# EAGLE design RAM_TheoreticalDiagram (EAGLE 7.6.0)
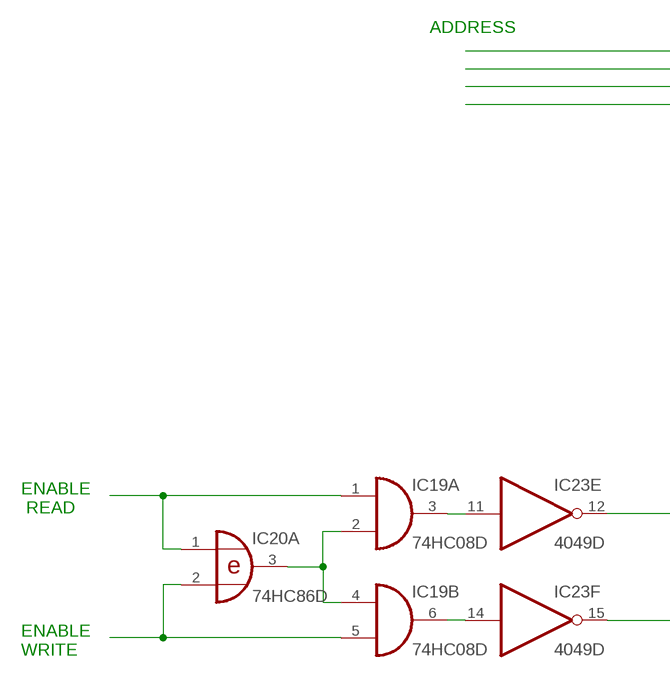
[diagram p0: schematic, sheet 1, part 1 of 2]
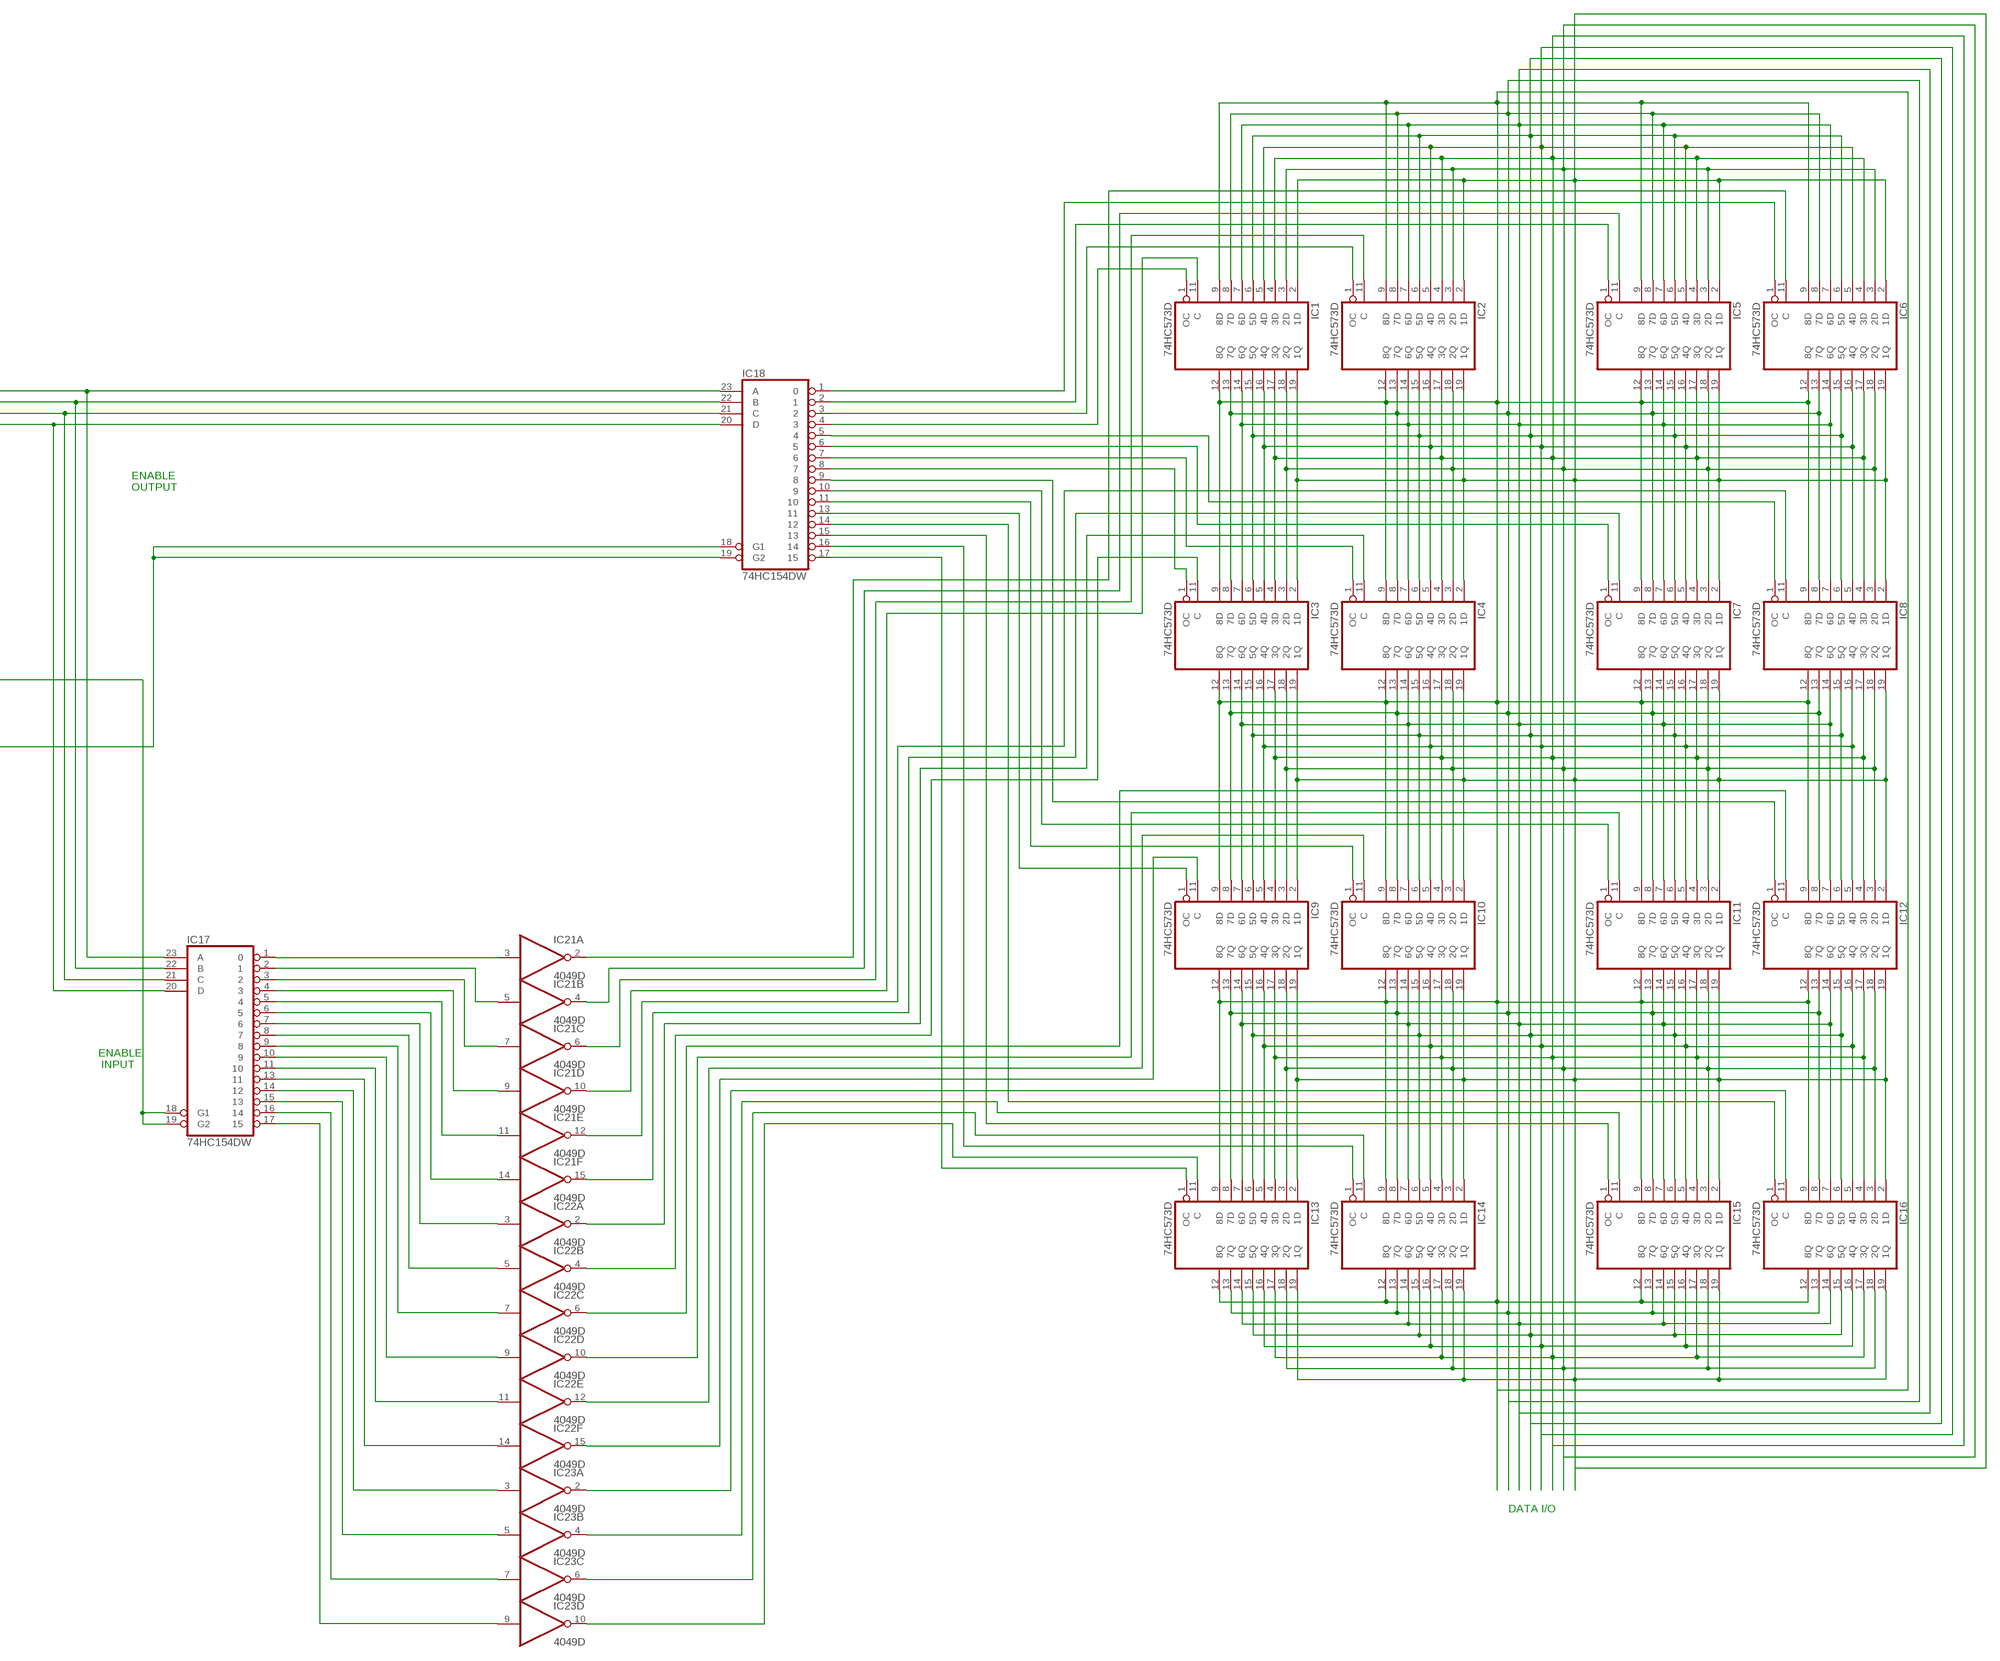
[diagram p1: schematic, sheet 1, part 2 of 2]

## Parts
IC1  74HC573D  [SO20W]
IC2  74HC573D  [SO20W]
IC3  74HC573D  [SO20W]
IC4  74HC573D  [SO20W]
IC5  74HC573D  [SO20W]
IC6  74HC573D  [SO20W]
IC7  74HC573D  [SO20W]
IC8  74HC573D  [SO20W]
IC9  74HC573D  [SO20W]
IC10  74HC573D  [SO20W]
IC11  74HC573D  [SO20W]
IC12  74HC573D  [SO20W]
IC13  74HC573D  [SO20W]
IC14  74HC573D  [SO20W]
IC15  74HC573D  [SO20W]
IC16  74HC573D  [SO20W]
IC17  74HC154DW  [SO24W]
IC18  74HC154DW  [SO24W]
IC19  74HC08D  [SO14]
IC20  74HC86D  [SO14]
IC21  4049D  [SO16]
IC22  4049D  [SO16]
IC23  4049D  [SO16]

## Nets
N$1: IC16.11(C) IC23.2(A:O)
N$2: IC16.1(OC) IC18.14
N$3: IC15.11(C) IC23.4(B:O)
N$4: IC15.1(OC) IC18.15
N$5: IC14.11(C) IC23.6(C:O)
N$6: IC14.1(OC) IC18.16
N$7: IC13.11(C) IC23.10(D:O)
N$8: IC13.1(OC) IC18.17
N$9: IC12.11(C) IC22.6(C:O)
N$11: IC1.9(8D) IC1.12(8Q) IC2.9(8D) IC2.12(8Q) IC3.9(8D) IC3.12(8Q) IC4.9(8D) IC4.12(8Q) IC5.9(8D) IC5.12(8Q) IC6.9(8D) IC6.12(8Q) IC7.9(8D) IC7.12(8Q) IC8.9(8D) IC8.12(8Q) IC9.9(8D) IC9.12(8Q) IC10.9(8D) IC10.12(8Q) IC11.9(8D) IC11.12(8Q) IC12.9(8D) IC12.12(8Q) IC13.9(8D) IC13.12(8Q) IC14.9(8D) IC14.12(8Q) IC15.9(8D) IC15.12(8Q) IC16.9(8D) IC16.12(8Q)
N$12: IC1.8(7D) IC1.13(7Q) IC2.8(7D) IC2.13(7Q) IC3.8(7D) IC3.13(7Q) IC4.8(7D) IC4.13(7Q) IC5.8(7D) IC5.13(7Q) IC6.8(7D) IC6.13(7Q) IC7.8(7D) IC7.13(7Q) IC8.8(7D) IC8.13(7Q) IC9.8(7D) IC9.13(7Q) IC10.8(7D) IC10.13(7Q) IC11.8(7D) IC11.13(7Q) IC12.8(7D) IC12.13(7Q) IC13.8(7D) IC13.13(7Q) IC14.8(7D) IC14.13(7Q) IC15.8(7D) IC15.13(7Q) IC16.8(7D) IC16.13(7Q)
N$13: IC12.1(OC) IC18.9
N$14: IC10.11(C) IC22.12(E:O)
N$15: IC11.11(C) IC22.10(D:O)
N$16: IC11.1(OC) IC18.10
N$17: IC10.1(OC) IC18.11
N$18: IC9.11(C) IC22.15(F:O)
N$19: IC9.1(OC) IC18.13
N$20: IC8.1(OC) IC18.5
N$21: IC19.2(A:I1) IC19.4(B:I0) IC20.3(A:O)
N$22: IC8.11(C) IC21.12(E:O)
N$23: IC7.11(C) IC21.15(F:O)
N$24: IC7.1(OC) IC18.6
N$27: IC1.5(4D) IC1.16(4Q) IC2.5(4D) IC2.16(4Q) IC3.5(4D) IC3.16(4Q) IC4.5(4D) IC4.16(4Q) IC5.5(4D) IC5.16(4Q) IC6.5(4D) IC6.16(4Q) IC7.5(4D) IC7.16(4Q) IC8.5(4D) IC8.16(4Q) IC9.5(4D) IC9.16(4Q) IC10.5(4D) IC10.16(4Q) IC11.5(4D) IC11.16(4Q) IC12.5(4D) IC12.16(4Q) IC13.5(4D) IC13.16(4Q) IC14.5(4D) IC14.16(4Q) IC15.5(4D) IC15.16(4Q) IC16.5(4D) IC16.16(4Q)
N$28: IC19.1(A:I0) IC20.1(A:I0)
N$29: IC4.11(C) IC22.2(A:O)
N$30: IC4.1(OC) IC18.7
N$31: IC3.11(C) IC22.4(B:O)
N$32: IC1.3(2D) IC1.18(2Q) IC2.3(2D) IC2.18(2Q) IC3.3(2D) IC3.18(2Q) IC4.3(2D) IC4.18(2Q) IC5.3(2D) IC5.18(2Q) IC6.3(2D) IC6.18(2Q) IC7.3(2D) IC7.18(2Q) IC8.3(2D) IC8.18(2Q) IC9.3(2D) IC9.18(2Q) IC10.3(2D) IC10.18(2Q) IC11.3(2D) IC11.18(2Q) IC12.3(2D) IC12.18(2Q) IC13.3(2D) IC13.18(2Q) IC14.3(2D) IC14.18(2Q) IC15.3(2D) IC15.18(2Q) IC16.3(2D) IC16.18(2Q)
N$33: IC3.1(OC) IC18.8
N$34: IC6.11(C) IC21.2(A:O)
N$35: IC6.1(OC) IC18.1
N$36: IC5.11(C) IC21.4(B:O)
N$37: IC5.1(OC) IC18.2
N$38: IC2.11(C) IC21.6(C:O)
N$39: IC2.1(OC) IC18.3
N$40: IC1.11(C) IC21.10(D:O)
N$41: IC1.1(OC) IC18.4
N$42: IC18.18(G1) IC18.19(G2) IC23.15(F:O)
N$43: IC17.18(G1) IC17.19(G2) IC23.12(E:O)
N$46: IC19.5(B:I1) IC20.2(A:I1)
N$47: IC17.1 IC21.3(A:I)
N$48: IC17.23(A) IC18.23(A)
N$49: IC17.22(B) IC18.22(B)
N$50: IC17.21(C) IC18.21(C)
N$51: IC17.20(D) IC18.20(D)
N$52: IC17.2 IC21.5(B:I)
N$53: IC17.3 IC21.7(C:I)
N$54: IC17.4 IC21.9(D:I)
N$55: IC17.5 IC21.11(E:I)
N$56: IC17.6 IC21.14(F:I)
N$58: IC17.7 IC22.3(A:I)
N$59: IC17.8 IC22.5(B:I)
N$60: IC17.9 IC22.7(C:I)
N$61: IC17.10 IC22.9(D:I)
N$62: IC17.11 IC22.11(E:I)
N$64: IC17.13 IC22.14(F:I)
N$66: IC17.14 IC23.3(A:I)
N$67: IC17.15 IC23.5(B:I)
N$68: IC17.16 IC23.7(C:I)
N$69: IC17.17 IC23.9(D:I)
N$70: IC1.7(6D) IC1.14(6Q) IC2.7(6D) IC2.14(6Q) IC3.7(6D) IC3.14(6Q) IC4.7(6D) IC4.14(6Q) IC5.7(6D) IC5.14(6Q) IC6.7(6D) IC6.14(6Q) IC7.7(6D) IC7.14(6Q) IC8.7(6D) IC8.14(6Q) IC9.7(6D) IC9.14(6Q) IC10.7(6D) IC10.14(6Q) IC11.7(6D) IC11.14(6Q) IC12.7(6D) IC12.14(6Q) IC13.7(6D) IC13.14(6Q) IC14.7(6D) IC14.14(6Q) IC15.7(6D) IC15.14(6Q) IC16.7(6D) IC16.14(6Q)
N$72: IC19.3(A:O) IC23.11(E:I)
N$73: IC19.6(B:O) IC23.14(F:I)
N$98: IC1.2(1D) IC1.19(1Q) IC2.2(1D) IC2.19(1Q) IC3.2(1D) IC3.19(1Q) IC4.2(1D) IC4.19(1Q) IC5.2(1D) IC5.19(1Q) IC6.2(1D) IC6.19(1Q) IC7.2(1D) IC7.19(1Q) IC8.2(1D) IC8.19(1Q) IC9.2(1D) IC9.19(1Q) IC10.2(1D) IC10.19(1Q) IC11.2(1D) IC11.19(1Q) IC12.2(1D) IC12.19(1Q) IC13.2(1D) IC13.19(1Q) IC14.2(1D) IC14.19(1Q) IC15.2(1D) IC15.19(1Q) IC16.2(1D) IC16.19(1Q)
N$100: IC1.4(3D) IC1.17(3Q) IC2.4(3D) IC2.17(3Q) IC3.4(3D) IC3.17(3Q) IC4.4(3D) IC4.17(3Q) IC5.4(3D) IC5.17(3Q) IC6.4(3D) IC6.17(3Q) IC7.4(3D) IC7.17(3Q) IC8.4(3D) IC8.17(3Q) IC9.4(3D) IC9.17(3Q) IC10.4(3D) IC10.17(3Q) IC11.4(3D) IC11.17(3Q) IC12.4(3D) IC12.17(3Q) IC13.4(3D) IC13.17(3Q) IC14.4(3D) IC14.17(3Q) IC15.4(3D) IC15.17(3Q) IC16.4(3D) IC16.17(3Q)
N$102: IC1.6(5D) IC1.15(5Q) IC2.6(5D) IC2.15(5Q) IC3.6(5D) IC3.15(5Q) IC4.6(5D) IC4.15(5Q) IC5.6(5D) IC5.15(5Q) IC6.6(5D) IC6.15(5Q) IC7.6(5D) IC7.15(5Q) IC8.6(5D) IC8.15(5Q) IC9.6(5D) IC9.15(5Q) IC10.6(5D) IC10.15(5Q) IC11.6(5D) IC11.15(5Q) IC12.6(5D) IC12.15(5Q) IC13.6(5D) IC13.15(5Q) IC14.6(5D) IC14.15(5Q) IC15.6(5D) IC15.15(5Q) IC16.6(5D) IC16.15(5Q)
Unconnected: IC19.8(C:O) IC19.9(C:I0) IC19.10(C:I1) IC19.11(D:O) IC19.12(D:I0) IC19.13(D:I1) IC20.4(B:I0) IC20.5(B:I1) IC20.6(B:O) IC20.8(C:O) IC20.9(C:I0) IC20.10(C:I1) IC20.11(D:O) IC20.12(D:I0) IC20.13(D:I1)

## Notes on the sheet
- ADDRESS
- ENABLE
  OUTPUT
- ENABLE
   READ
- ENABLE
  WRITE
- ENABLE
   INPUT
- DATA I/O

## Power pins joined to a net without a drawn wire
N$101: IC1.10(GND) IC2.10(GND) IC3.10(GND) IC4.10(GND) IC5.10(GND) IC6.10(GND) IC7.10(GND) IC8.10(GND) IC9.10(GND) IC10.10(GND) IC11.10(GND) IC12.10(GND) IC13.10(GND) IC14.10(GND) IC15.10(GND) IC16.10(GND) IC17.12(GND) IC18.12(GND) IC19.7(P:GND) IC20.7(P:GND)
N$103: IC1.20(VCC) IC2.20(VCC) IC3.20(VCC) IC4.20(VCC) IC5.20(VCC) IC6.20(VCC) IC7.20(VCC) IC8.20(VCC) IC9.20(VCC) IC10.20(VCC) IC11.20(VCC) IC12.20(VCC) IC13.20(VCC) IC14.20(VCC) IC15.20(VCC) IC16.20(VCC) IC17.24(VCC) IC18.24(VCC) IC19.14(P:VCC) IC20.14(P:VCC)
VDD: IC21.1(P:VDD) IC22.1(P:VDD) IC23.1(P:VDD)
VSS: IC21.8(P:VSS) IC22.8(P:VSS) IC23.8(P:VSS)

## Library data of the parts
IC1-IC16 = 74xx-eu:74*573: 8-bit D latch BUS DRIVER
IC17 IC18 = 74xx-eu:74*154: 4-line to 16-line data SELECTOR/MULTIPLEXER
IC19 = 74xx-eu:74*08: Quad 2-input AND gate
IC20 = 74xx-eu:74*86: Quad 2-input EXCLUSIVE-OR (XOR) gate
IC21-IC23 = 40xx:4049: Hex inverting BUFFER

## Board
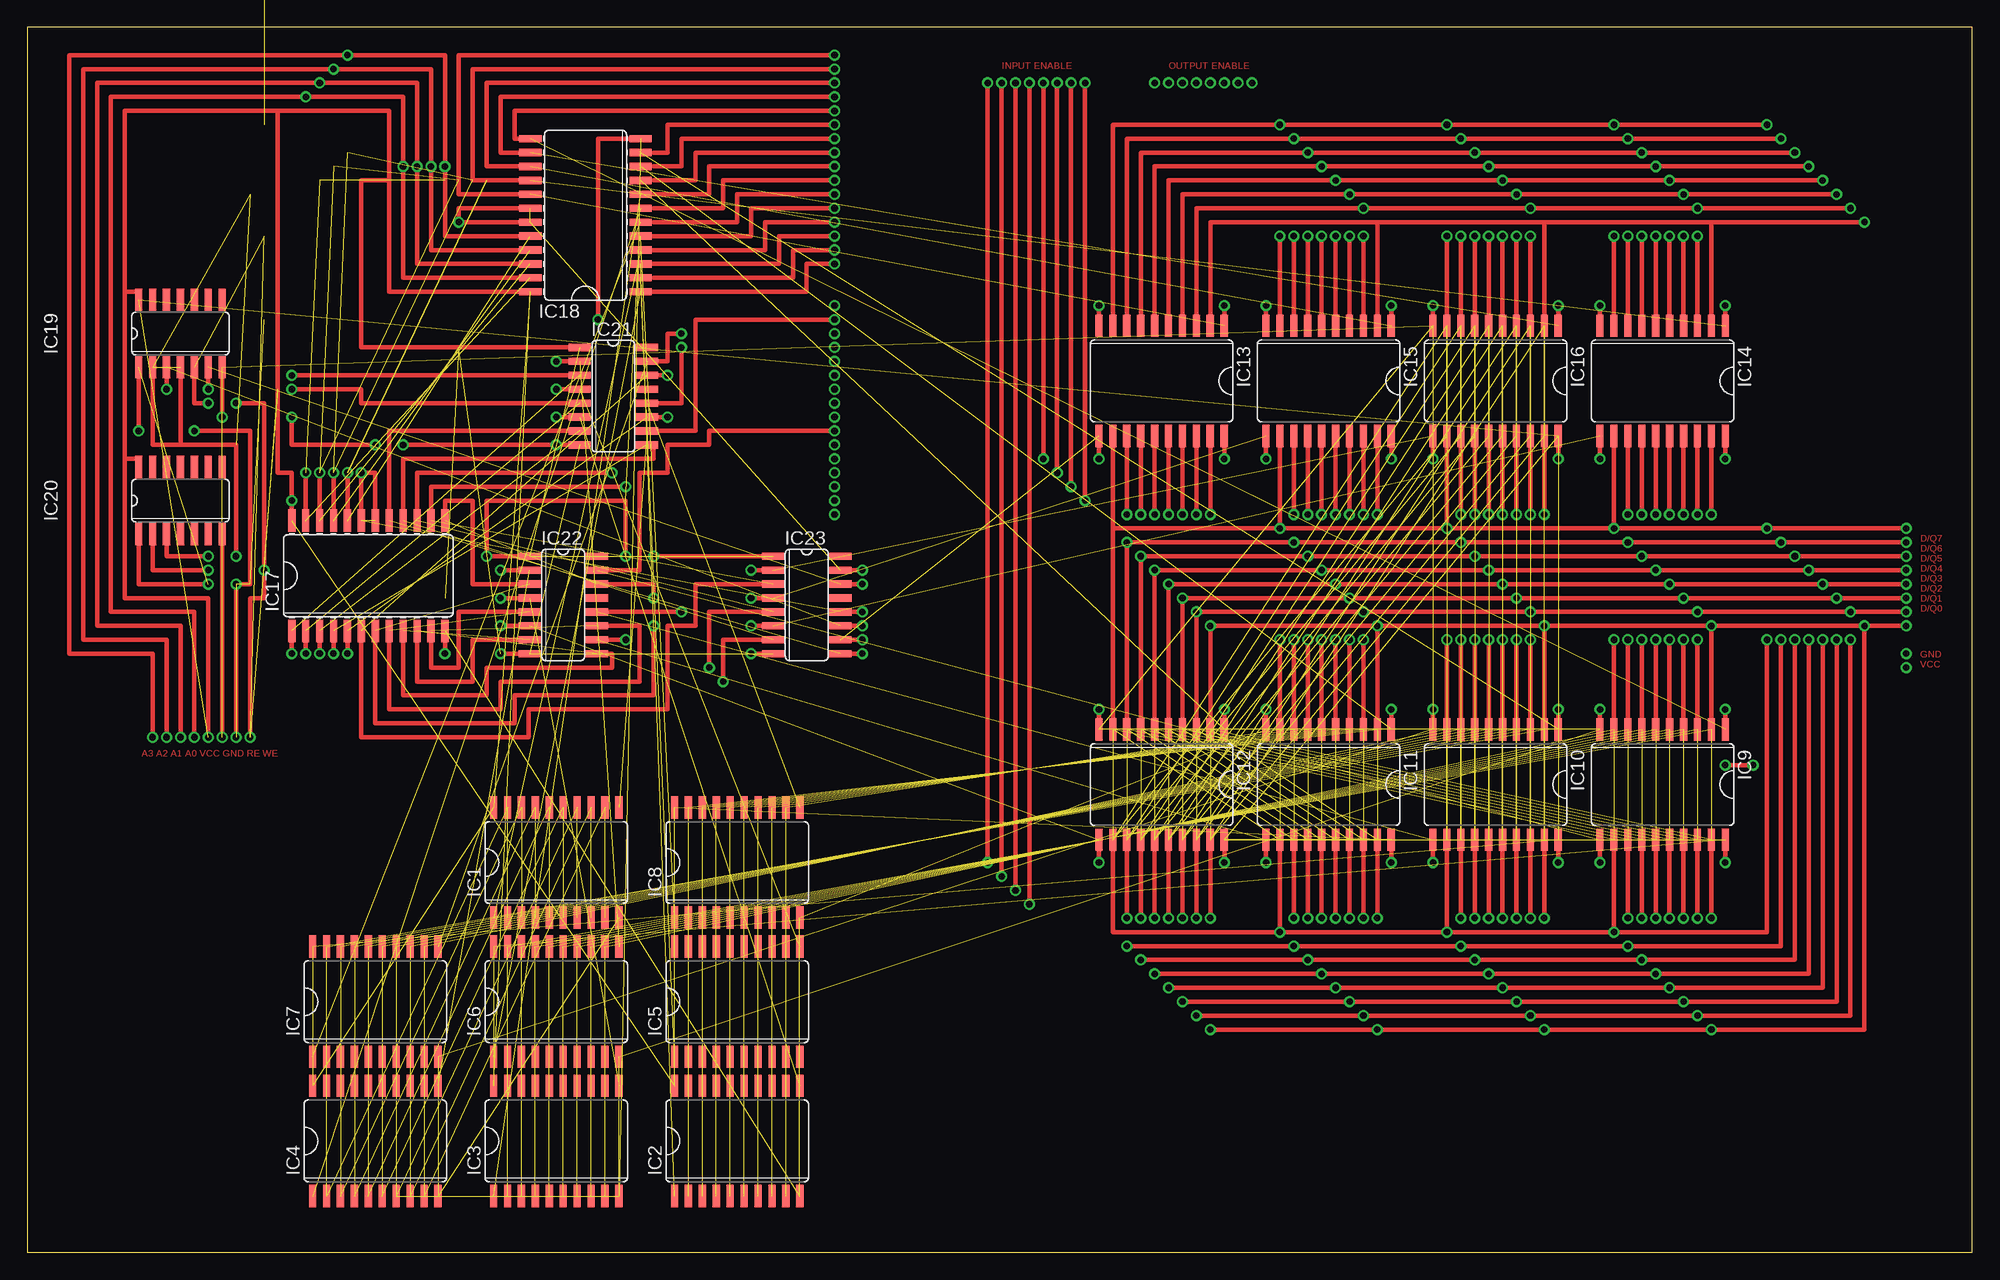
[diagram p2: board, top side]
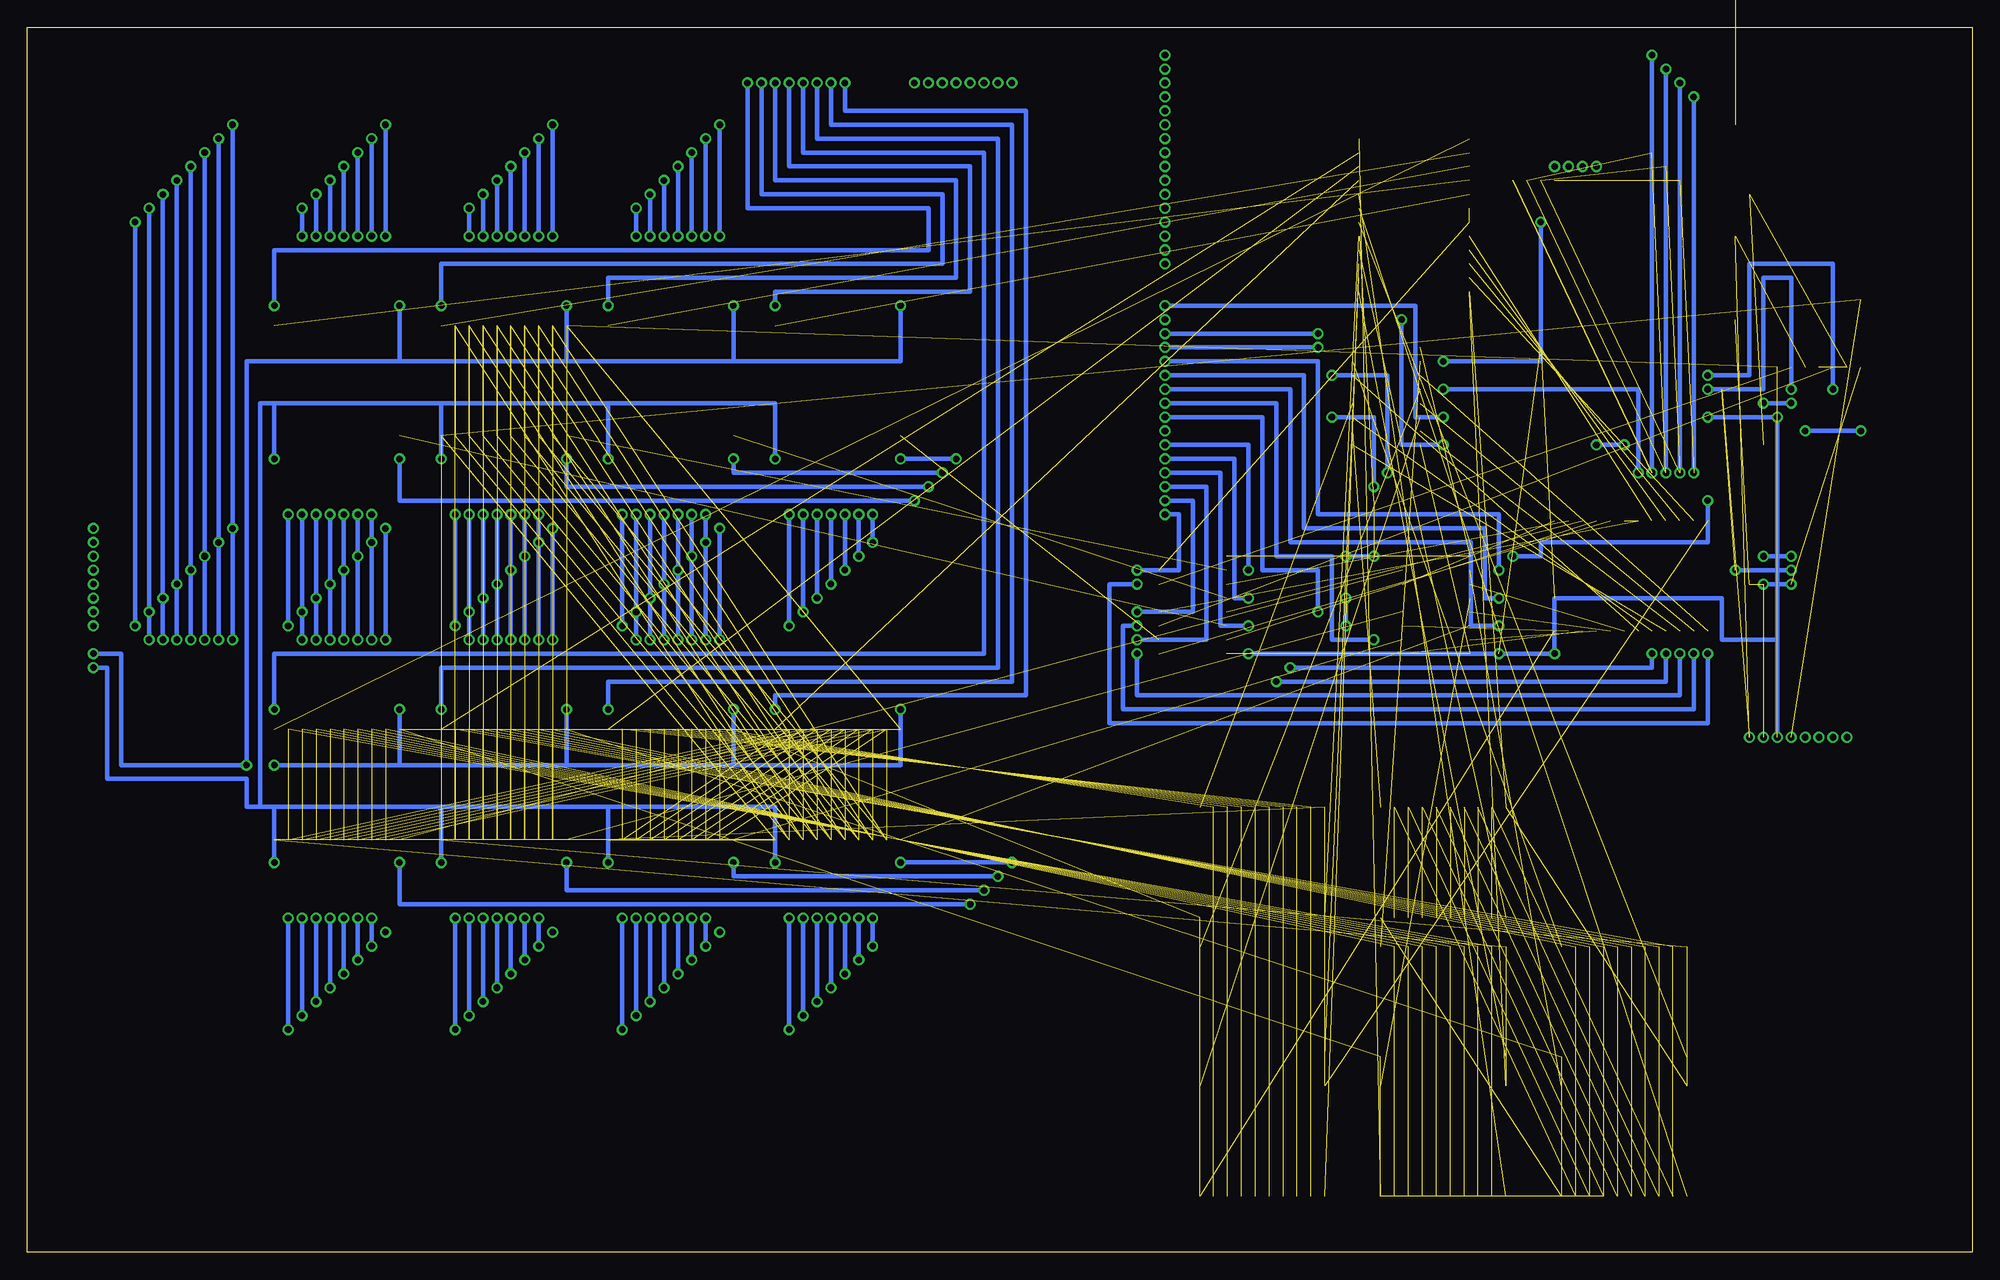
[diagram p3: board, bottom side, seen from below]

Size 177.47 x 111.75 mm. Coordinates in mm from the lower left corner, seen from the top.
Outline: 0,0 177.47,0 177.47,111.75 0,111.75 0,0
Copper layers (1*16): Top 0.035mm / dielectric 1.5mm / Bottom 0.035mm
Design rules "default": minimum track width 6mil, minimum drill 0.35mm, track to track 6mil, track to pad 6mil, pad to pad 6mil, via to via 6mil, smd to smd 6mil, copper to edge 40mil, drill to drill 6mil, minimum pad ring 10mil, minimum via ring 8mil, stop-mask expansion 4mil, vias tented up to drill 0mil, thermal gap 10mil

### Footprints (pad centres in the part's own frame; a part is rotated, then mirrored left to right if it is on the bottom)
SO20W = smd 0.66 x 2.032: 1 -5.715,-5.029; 2 -4.445,-5.029; 3 -3.175,-5.029; 4 -1.905,-5.029; 5 -0.635,-5.029; 6 0.635,-5.029; 7 1.905,-5.029; 8 3.175,-5.029; 9 4.445,-5.029; 10 5.715,-5.029; 11 5.715,5.029; 12 4.445,5.029; 13 3.175,5.029; 14 1.905,5.029; 15 0.635,5.029; 16 -0.635,5.029; 17 -1.905,5.029; 18 -3.175,5.029; 19 -4.445,5.029; 20 -5.715,5.029
SO24W = smd 0.66 x 2.032: 1 -6.985,-5.029; 2 -5.715,-5.029; 3 -4.445,-5.029; 4 -3.175,-5.029; 5 -1.905,-5.029; 6 -0.635,-5.029; 7 0.635,-5.029; 8 1.905,-5.029; 9 3.175,-5.029; 10 4.445,-5.029; 11 5.715,-5.029; 12 6.985,-5.029; 13 6.985,5.029; 14 5.715,5.029; 15 4.445,5.029; 16 3.175,5.029; 17 1.905,5.029; 18 0.635,5.029; 19 -0.635,5.029; 20 -1.905,5.029; 21 -3.175,5.029; 22 -4.445,5.029; 23 -5.715,5.029; 24 -6.985,5.029
SO14 = smd 0.66 x 2.032: 1 -3.81,-3.073; 2 -2.54,-3.073; 3 -1.27,-3.073; 4 0,-3.073; 5 1.27,-3.073; 6 2.54,-3.073; 7 3.81,-3.073; 8 3.81,3.073; 9 2.54,3.073; 10 1.27,3.073; 11 0,3.073; 12 -1.27,3.073; 13 -2.54,3.073; 14 -3.81,3.073
SO16 = smd 0.66 x 2.032: 1 -4.445,-3.073; 2 -3.175,-3.073; 3 -1.905,-3.073; 4 -0.635,-3.073; 5 0.635,-3.073; 6 1.905,-3.073; 7 3.175,-3.073; 8 4.445,-3.073; 9 4.445,3.073; 10 3.175,3.073; 11 1.905,3.073; 12 0.635,3.073; 13 -0.635,3.073; 14 -1.905,3.073; 15 -3.175,3.073; 16 -4.445,3.073

### Placement (x,y rotation side)
IC1  48.26,35.56 0 top
IC2  64.77,10.16 0 top
IC3  48.26,10.16 0 top
IC4  31.75,10.16 0 top
IC5  64.77,22.86 0 top
IC6  48.26,22.86 0 top
IC7  31.75,22.86 0 top
IC8  64.77,35.56 0 top
IC9  149.22,42.67 180 top
IC10  133.99,42.67 180 top
IC11  118.75,42.67 180 top
IC12  103.5,42.67 180 top
IC13  103.5,79.5 180 top
IC14  149.22,79.5 180 top
IC15  118.75,79.5 180 top
IC16  133.99,79.5 180 top
IC17  31.11,61.72 0 top
IC18  50.93,94.61 90 top
IC19  13.97,83.82 0 top
IC20  13.97,68.58 0 top
IC21  53.47,78.11 270 top
IC22  48.9,59.05 270 top
IC23  71.12,59.05 270 top

### Tracks (layer width: path | path; a pad name or v marks a point on that pad's centre or on a via)
N$1  (1 unrouted)
N$2  (1 unrouted)
N$3  (1 unrouted)
N$4  (1 unrouted)
N$5  (1 unrouted)
N$6  (1 unrouted)
N$7  (1 unrouted)
N$8  (1 unrouted)
N$9  (1 unrouted)
N$11  (31 unrouted)
N$12  (31 unrouted)
N$13  (1 unrouted)
N$14  (1 unrouted)
N$15  (1 unrouted)
N$16  (1 unrouted)
N$17  (1 unrouted)
N$18  (1 unrouted)
N$19  (1 unrouted)
N$20  (1 unrouted)
N$21  (via drill 0.6)  (3 unrouted)
  Top 0.406: IC20.3 12.7,63.5 v16.51,63.5 | v19.05,63.5 19.05,73.66 13.97,73.66 | 13.97,73.66 11.43,73.66 11.43,80.01 | 13.97,80.01 13.97,73.66
  Bottom 0.406: v16.51,63.5 v19.05,63.5
N$22  (1 unrouted)
N$23  (1 unrouted)
N$24  (1 unrouted)
N$25  (via drill 0.6)
  other vias: 16.51,46.99
N$26  (via drill 0.6)
  other vias: 19.05,63.5
N$27  (31 unrouted)
N$28  (via drill 0.6)  (4 unrouted)
  Top 0.406: IC20.1 10.16,60.96 v16.51,60.96 | v15.24,74.93 20.32,74.93 20.32,60.96 v19.05,60.96 v19.05,46.99 | v10.16,74.93 10.16,80.01
  Bottom 0.406: v19.05,60.96 v16.51,60.96 | v15.24,74.93 v10.16,74.93
N$29  (1 unrouted)
N$30  (1 unrouted)
N$31  (1 unrouted)
N$32  (31 unrouted)
N$33  (1 unrouted)
N$34  (1 unrouted)
N$35  (1 unrouted)
N$36  (1 unrouted)
N$37  (1 unrouted)
N$38  (1 unrouted)
N$39  (1 unrouted)
N$40  (1 unrouted)
N$41  (1 unrouted)
N$42  (2 unrouted)
N$43  (2 unrouted)
N$44  (via drill 0.6)
  Top 0.406: 49.53,76.2 v48.26,76.2
  Bottom 0.406: v48.26,76.2 50.8,76.2 50.8,86.36 v73.66,86.36
N$45  (via drill 0.6)
  Top 0.406: 12.7,80.01 v12.7,78.74 | v24.13,80.01 49.53,80.01
  Bottom 0.406: v12.7,78.74 12.7,90.17 20.32,90.17 20.32,80.01 v24.13,80.01
N$46  (via drill 0.6)  (4 unrouted)
  Top 0.406: IC20.2 11.43,62.23 v16.51,62.23 | v19.05,77.47 21.59,77.47 v21.59,62.23 21.59,59.69 20.32,59.69 v20.32,46.99 | v16.51,77.47 15.24,77.47 15.24,80.01
  Bottom 0.406: v16.51,62.23 v21.59,62.23 | v19.05,77.47 v16.51,77.47
N$47  (1 unrouted)
N$48  (1 unrouted)
N$49  (1 unrouted)
N$50  (1 unrouted)
N$51  (1 unrouted)
N$52  (1 unrouted)
N$53  (1 unrouted)
N$54  (1 unrouted)
N$55  (1 unrouted)
N$56  (1 unrouted)
N$57  (via drill 0.6)  (3 unrouted)
  Top 0.406: v29.21,71.12 29.21,67.31 | v11.43,46.99 11.43,54.61 3.81,54.61 3.81,109.22 v29.21,109.22 38.1,109.22 v38.1,99.06 38.1,92.71 45.72,92.71
  Bottom 0.406: v29.21,109.22 v29.21,71.12
N$58  (1 unrouted)
N$59  (1 unrouted)
N$60  (1 unrouted)
N$61  (1 unrouted)
N$62  (1 unrouted)
N$63  (via drill 0.6)  (4 unrouted)
  Top 0.406: v12.7,46.99 12.7,55.88 5.08,55.88 5.08,107.95 v27.94,107.95 36.83,107.95 v36.83,99.06 36.83,91.44 45.72,91.44 | v27.94,71.12 27.94,67.31
  Bottom 0.406: v27.94,71.12 v27.94,107.95
N$64  (1 unrouted)
N$65  (via drill 0.6)  (2 unrouted)
  Top 0.406: v15.24,46.99 15.24,58.42 7.62,58.42 7.62,105.41 v25.4,105.41 34.29,105.41 v34.29,99.06 34.29,88.9 45.72,88.9 | v25.4,71.12 25.4,67.31
  Bottom 0.406: v25.4,71.12 v25.4,105.41
N$66  (1 unrouted)
N$67  (1 unrouted)
N$68  (1 unrouted)
N$69  (1 unrouted)
N$70  (31 unrouted)
N$71  (via drill 0.6)  (4 unrouted)
  Top 0.406: v13.97,46.99 13.97,57.15 6.35,57.15 6.35,106.68 v26.67,106.68 35.56,106.68 v35.56,99.06 35.56,90.17 45.72,90.17 | v26.67,71.12 26.67,67.31
  Bottom 0.406: v26.67,106.68 v26.67,71.12
N$72  (1 unrouted)
N$73  (1 unrouted)
N$74  (via drill 0.6)
  Top 0.406: 16.51,80.01 v16.51,78.74 | v24.13,78.74 30.48,78.74 30.48,77.47 49.53,77.47
  Bottom 0.406: v16.51,78.74 16.51,88.9 19.05,88.9 19.05,78.74 v24.13,78.74
N$75
  Top 0.406: 57.15,73.66 57.15,72.39 34.29,72.39 34.29,67.31
N$76  (via drill 0.6)
  Top 0.406: 49.53,78.74 v48.26,78.74 | 31.75,67.31 31.75,71.12 v30.48,71.12 30.48,67.31
  Bottom 0.406: v48.26,78.74 30.48,78.74 v30.48,71.12
N$77  (2 unrouted)
N$78  (via drill 0.6)
  Top 0.406: v76.2,55.88 74.93,55.88
  Bottom 0.406: v76.2,55.88 69.85,55.88 69.85,69.85 v73.66,69.85
N$79  (via drill 0.6)
  Top 0.406: 49.53,81.28 v48.26,81.28 | 45.72,95.25 39.37,95.25 v39.37,93.98 45.72,93.98
  Bottom 0.406: v48.26,81.28 39.37,81.28 v39.37,93.98
N$80  (via drill 0.6)
  Top 0.406: 35.56,67.31 35.56,71.12 v53.34,71.12 | v58.42,80.01 57.15,80.01
  Bottom 0.406: v53.34,71.12 53.34,80.01 v58.42,80.01
N$81
  Top 0.406: 33.02,67.31 33.02,74.93 49.53,74.93
N$82
  Top 0.406: 35.56,55.88 35.56,52.07 40.64,52.07 40.64,55.88 45.72,55.88
N$83  (via drill 0.6)
  Top 0.406: 36.83,67.31 36.83,69.85 v54.61,69.85 | v58.42,76.2 57.15,76.2
  Bottom 0.406: v54.61,69.85 54.61,76.2 v58.42,76.2
N$84  (via drill 0.6)
  Top 0.406: v76.2,58.42 74.93,58.42
  Bottom 0.406: v76.2,58.42 71.12,58.42 71.12,68.58 v73.66,68.58
N$85  (via drill 0.6)
  Top 0.406: 57.15,81.28 58.42,81.28 58.42,83.82 v59.69,83.82
  Bottom 0.406: v73.66,83.82 v59.69,83.82
N$86
  Top 0.406: 45.72,60.96 40.64,60.96 40.64,68.58 38.1,68.58 38.1,67.31
N$87  (via drill 0.6)
  Top 0.406: 57.15,74.93 60.96,74.93 60.96,85.09 v73.66,85.09
N$88  (via drill 0.6)
  Top 0.406: 45.72,62.23 v43.18,62.23
  Bottom 0.406: v43.18,62.23 43.18,67.31 59.69,67.31 59.69,81.28 v73.66,81.28
N$89
  Top 0.406: 36.83,55.88 36.83,53.34 39.37,53.34 39.37,58.42 45.72,58.42
N$90  (via drill 0.6)
  Top 0.406: 45.72,59.69 v43.18,59.69
  Bottom 0.406: v43.18,59.69 44.45,59.69 44.45,66.04 60.96,66.04 60.96,80.01 v73.66,80.01
N$91  (via drill 0.6)
  Top 0.406: 57.15,77.47 59.69,77.47 v59.69,82.55
  Bottom 0.406: v59.69,82.55 v73.66,82.55
N$92  (via drill 0.6)
  Top 0.406: 45.72,57.15 v43.18,57.15
  Bottom 0.406: v43.18,57.15 45.72,57.15 45.72,64.77 62.23,64.77 62.23,78.74 v73.66,78.74
N$93
  Top 0.406: 34.29,55.88 34.29,50.8 41.91,50.8 41.91,53.34 53.34,53.34 53.34,54.61 52.07,54.61
N$94
  Top 0.406: 33.02,55.88 33.02,49.53 43.18,49.53 43.18,52.07 55.88,52.07 55.88,57.15 52.07,57.15
N$95  (via drill 0.6)
  Top 0.406: 53.34,55.88 v54.61,55.88 52.07,55.88
  Bottom 0.406: v54.61,55.88 58.42,55.88 58.42,63.5 63.5,63.5 63.5,77.47 v73.66,77.47
N$96  (via drill 0.6)
  Top 0.406: 52.07,58.42 v59.69,58.42
  Bottom 0.406: v73.66,76.2 64.77,76.2 64.77,62.23 59.69,62.23 v59.69,58.42
N$97  (via drill 0.6)
  Top 0.406: 52.07,62.23 55.88,62.23 55.88,71.12 58.42,71.12 58.42,73.66 62.23,73.66 62.23,74.93 v73.66,74.93
N$98  (31 unrouted)
N$99  (via drill 0.6)
  Top 0.406: 31.75,55.88 31.75,48.26 44.45,48.26 44.45,50.8 57.15,50.8 v57.15,57.15 | v57.15,59.69 57.15,60.96 52.07,60.96
  Bottom 0.406: v57.15,57.15 v57.15,59.69
N$100  (31 unrouted)
N$101  (via drill 0.6)  (21 unrouted)
  Top 0.406: 49.53,73.66 v48.26,73.66 v34.29,73.66 | v31.75,73.66 24.13,73.66 v24.13,76.2 | IC20.7 v17.78,46.99 | 17.78,80.01 v17.78,76.2 | 38.1,55.88 v38.1,54.61 | 45.72,54.61 v43.18,54.61 | 67.31,54.61 v66.04,54.61 | v52.07,85.09 52.07,101.6 55.88,101.6
  Bottom 0.406: v17.78,46.99 17.78,55.88 | 17.78,55.88 v17.78,76.2 v24.13,76.2 | v34.29,73.66 v31.75,73.66 | 17.78,55.88 22.86,55.88 22.86,59.69 38.1,59.69 v38.1,54.61 v43.18,54.61 v66.04,54.61 | v48.26,73.66 52.07,73.66 v52.07,85.09
N$102  (31 unrouted)
N$103  (via drill 0.6)  (21 unrouted)
  Top 0.406: 67.31,63.5 v57.15,63.5 | v54.61,63.5 54.61,68.58 41.91,68.58 v41.91,63.5 45.72,63.5 | 50.8,82.55 30.48,82.55 30.48,97.79 33.02,97.79 | 10.16,87.63 8.89,87.63 | IC20.14 10.16,72.39 8.89,72.39 | 8.89,72.39 8.89,59.69 16.51,59.69 16.51,46.99 | 8.89,87.63 8.89,72.39 | 8.89,87.63 8.89,104.14 22.86,104.14 | 22.86,104.14 33.02,104.14 33.02,97.79 | 22.86,104.14 22.86,71.12 24.13,71.12 v24.13,68.58 24.13,67.31 | 33.02,97.79 33.02,87.63 45.72,87.63
  Bottom 0.406: v24.13,68.58 24.13,64.77 39.37,64.77 39.37,63.5 v41.91,63.5 | v57.15,63.5 v54.61,63.5
N$104  (via drill 0.6)
  Top 0.406: v76.2,62.23 74.93,62.23
  Bottom 0.406: v76.2,62.23 72.39,62.23 72.39,67.31 v73.66,67.31
N$105  (via drill 0.6)
  Top 0.406: 45.72,96.52 39.37,96.52 39.37,109.22 v73.66,109.22
N$106
  Top 0.406: 30.48,55.88 30.48,46.99 45.72,46.99 45.72,49.53 58.42,49.53 58.42,57.15 60.96,57.15 60.96,60.96 67.31,60.96
N$107  (via drill 0.6)
  Top 0.406: 67.31,62.23 v66.04,62.23
  Bottom 0.406: v66.04,62.23 66.04,73.66 v73.66,73.66
N$108  (via drill 0.6)
  Top 0.406: 29.21,55.88 v29.21,54.61 | v62.23,53.34 62.23,58.42 67.31,58.42
  Bottom 0.406: v29.21,54.61 29.21,53.34 v62.23,53.34
N$109  (via drill 0.6)
  Top 0.406: 27.94,55.88 v27.94,54.61 | v63.5,52.07 63.5,55.88 67.31,55.88
  Bottom 0.406: v27.94,54.61 27.94,52.07 v63.5,52.07
N$110  (via drill 0.6)
  Top 0.406: 26.67,55.88 v26.67,54.61 | v76.2,54.61 74.93,54.61
  Bottom 0.406: v26.67,54.61 26.67,50.8 76.2,50.8 v76.2,54.61
N$111  (via drill 0.6)
  Top 0.406: 45.72,97.79 40.64,97.79 40.64,107.95 v73.66,107.95
N$112  (via drill 0.6)
  Top 0.406: 24.13,55.88 v24.13,54.61 | v76.2,60.96 74.93,60.96
  Bottom 0.406: v24.13,54.61 24.13,48.26 78.74,48.26 78.74,60.96 v76.2,60.96
N$113  (via drill 0.6)
  Top 0.406: 67.31,59.69 v66.04,59.69
  Bottom 0.406: v66.04,59.69 67.31,59.69 67.31,72.39 v73.66,72.39
N$114  (via drill 0.6)
  Top 0.406: 67.31,57.15 v66.04,57.15
  Bottom 0.406: v66.04,57.15 68.58,57.15 68.58,71.12 v73.66,71.12
N$115  (via drill 0.6)
  Top 0.406: 45.72,99.06 41.91,99.06 41.91,106.68 v73.66,106.68
N$116  (via drill 0.6)
  Top 0.406: 25.4,55.88 v25.4,54.61 | v76.2,57.15 74.93,57.15
  Bottom 0.406: v76.2,57.15 77.47,57.15 77.47,49.53 25.4,49.53 v25.4,54.61
N$117  (via drill 0.6)
  Top 0.406: 45.72,100.33 43.18,100.33 43.18,105.41 v73.66,105.41
N$118  (via drill 0.6)
  Top 0.406: 45.72,101.6 44.45,101.6 44.45,104.14 v73.66,104.14
N$119  (via drill 0.6)
  Top 0.406: 57.15,100.33 58.42,100.33 58.42,102.87 v73.66,102.87
N$120  (via drill 0.6)
  Top 0.406: 57.15,99.06 59.69,99.06 59.69,101.6 v73.66,101.6
N$121  (via drill 0.6)
  Top 0.406: 57.15,97.79 60.96,97.79 60.96,100.33 v73.66,100.33
N$122  (via drill 0.6)
  Top 0.406: 57.15,96.52 62.23,96.52 62.23,99.06 v73.66,99.06
N$123  (via drill 0.6)
  Top 0.406: 57.15,95.25 63.5,95.25 63.5,97.79 v73.66,97.79
N$124  (via drill 0.6)
  Top 0.406: 57.15,93.98 64.77,93.98 64.77,96.52 v73.66,96.52
N$125  (via drill 0.6)
  Top 0.406: 55.88,92.71 66.04,92.71 66.04,95.25 v73.66,95.25
N$126  (via drill 0.6)
  Top 0.406: 55.88,91.44 67.31,91.44 67.31,93.98 v73.66,93.98
N$127  (via drill 0.6)
  Top 0.406: 55.88,90.17 68.58,90.17 68.58,92.71 v73.66,92.71
N$128  (via drill 0.6)
  Top 0.406: 57.15,88.9 69.85,88.9 69.85,91.44 v73.66,91.44
N$129  (via drill 0.6)
  Top 0.406: 55.88,87.63 71.12,87.63 71.12,90.17 v73.66,90.17
N$130  (via drill 0.6)
  Top 0.406: v109.22,49.53 109.22,48.26
  Bottom 0.406: v109.22,49.53 109.22,50.8 86.36,50.8 86.36,104.14 102.87,104.14 v102.87,106.68
N$131  (via drill 0.6)
  Top 0.406: v109.22,86.36 109.22,85.09
  Bottom 0.406: v109.22,86.36 109.22,87.63 91.44,87.63 91.44,99.06 107.95,99.06 v107.95,106.68
N$132  (via drill 0.6)
  Top 0.406: v124.46,49.53 124.46,48.26
  Bottom 0.406: v124.46,49.53 124.46,52.07 87.63,52.07 87.63,102.87 104.14,102.87 v104.14,106.68
N$135  (via drill 0.6)
  Top 0.406: v114.3,29.21 99.06,29.21 99.06,36.83 | v114.3,29.21 v129.54,29.21 | v129.54,29.21 v144.78,29.21 | v144.78,29.21 158.75,29.21 v158.75,55.88 | 114.3,36.83 v114.3,29.21 | v129.54,29.21 129.54,36.83 | v144.78,29.21 144.78,36.83 | 129.54,85.09 v129.54,92.71 | 144.78,85.09 v144.78,92.71 | 114.3,85.09 v114.3,92.71 | 99.06,85.09 99.06,102.87 v114.3,102.87 v129.54,102.87 v144.78,102.87 v158.75,102.87 | 129.54,48.26 v129.54,55.88 | 144.78,48.26 v144.78,55.88 | 114.3,48.26 v114.3,55.88 | 99.06,48.26 99.06,66.04 | 99.06,66.04 v114.3,66.04 | v114.3,66.04 v129.54,66.04 | v129.54,66.04 v144.78,66.04 | v144.78,66.04 v158.75,66.04 v171.45,66.04 | 99.06,73.66 99.06,66.04 | 114.3,73.66 v114.3,66.04 | v129.54,66.04 129.54,73.66 | v144.78,66.04 144.78,73.66
  Bottom 0.406: v114.3,92.71 v114.3,102.87 | v144.78,92.71 v144.78,102.87 | v129.54,92.71 v129.54,102.87 | v114.3,55.88 v114.3,66.04 | v144.78,55.88 v144.78,66.04 | v129.54,55.88 v129.54,66.04 | v158.75,102.87 v158.75,66.04 v158.75,55.88
N$136  (via drill 0.6)
  Top 0.406: v139.7,49.53 139.7,48.26
  Bottom 0.406: v139.7,49.53 139.7,53.34 88.9,53.34 88.9,101.6 105.41,101.6 v105.41,106.68
N$140  (via drill 0.6)
  Top 0.406: v124.46,86.36 124.46,85.09
  Bottom 0.406: v124.46,86.36 124.46,88.9 92.71,88.9 92.71,97.79 109.22,97.79 v109.22,106.68
N$142  (via drill 0.6)
  Top 0.406: v97.79,35.56 97.79,36.83 | v87.63,35.56 v87.63,106.68
  Bottom 0.406: v97.79,35.56 v87.63,35.56
N$143  (via drill 0.6)
  Top 0.406: v143.51,35.56 143.51,36.83 | v91.44,31.75 v91.44,106.68
  Bottom 0.406: v143.51,35.56 143.51,31.75 v91.44,31.75
N$144  (via drill 0.6)
  Top 0.406: v139.7,35.56 139.7,36.83 | v124.46,35.56 124.46,36.83 | 154.94,36.83 v154.94,35.56 | v109.22,35.56 109.22,36.83 | v139.7,72.39 139.7,73.66 | v124.46,72.39 124.46,73.66 | 154.94,73.66 v154.94,72.39 | v109.22,72.39 109.22,73.66
  Bottom 0.406: v139.7,35.56 139.7,40.64 | v124.46,35.56 124.46,40.64 | v154.94,35.56 154.94,40.64 | 154.94,40.64 139.7,40.64 | 139.7,40.64 124.46,40.64 | 124.46,40.64 109.22,40.64 v109.22,35.56 | 154.94,40.64 156.21,40.64 | 156.21,40.64 156.21,77.47 154.94,77.47 | v139.7,72.39 139.7,77.47 | v124.46,72.39 124.46,77.47 | v154.94,72.39 154.94,77.47 | 154.94,77.47 139.7,77.47 | 139.7,77.47 124.46,77.47 | 124.46,77.47 109.22,77.47 v109.22,72.39 | 156.21,40.64 157.48,40.64 157.48,43.18 170.18,43.18 170.18,53.34 v171.45,53.34
N$145  (via drill 0.6)
  Top 0.406: v128.27,35.56 128.27,36.83 | v90.17,33.02 v90.17,106.68
  Bottom 0.406: v128.27,35.56 128.27,33.02 v90.17,33.02
N$148  (via drill 0.6)
  Top 0.406: v105.41,67.31 105.41,73.66 | 135.89,48.26 v135.89,55.88 | 151.13,48.26 v151.13,55.88 | 105.41,48.26 v105.41,59.69 v120.65,59.69 v135.89,59.69 v151.13,59.69 v165.1,59.69 v171.45,59.69 | 120.65,48.26 v120.65,55.88 | v120.65,67.31 120.65,73.66 | v135.89,67.31 135.89,73.66 | v151.13,67.31 151.13,73.66 | 135.89,85.09 v135.89,92.71 | 151.13,85.09 v151.13,92.71 | 105.41,85.09 105.41,96.52 v120.65,96.52 v135.89,96.52 v151.13,96.52 v165.1,96.52 | 120.65,85.09 v120.65,92.71 | v105.41,30.48 105.41,36.83 | v105.41,22.86 v120.65,22.86 v135.89,22.86 v151.13,22.86 165.1,22.86 v165.1,55.88 | v120.65,30.48 120.65,36.83 | v135.89,30.48 135.89,36.83 | v151.13,30.48 151.13,36.83
  Bottom 0.406: v120.65,55.88 v120.65,59.69 v120.65,67.31 | v151.13,55.88 v151.13,59.69 v151.13,67.31 | v135.89,55.88 v135.89,59.69 v135.89,67.31 | v105.41,67.31 v105.41,59.69 | v120.65,96.52 v120.65,92.71 | v151.13,92.71 v151.13,96.52 | v135.89,92.71 v135.89,96.52 | v165.1,96.52 v165.1,59.69 v165.1,55.88 | v120.65,22.86 v120.65,30.48 | v135.89,22.86 v135.89,30.48 | v151.13,22.86 v151.13,30.48 | v105.41,30.48 v105.41,22.86
N$149  (via drill 0.6)
  Top 0.406: v154.94,49.53 154.94,48.26
  Bottom 0.406: v154.94,49.53 154.94,54.61 90.17,54.61 90.17,100.33 106.68,100.33 v106.68,106.68
N$150  (via drill 0.6)
  Top 0.406: v139.7,86.36 139.7,85.09
  Bottom 0.406: v139.7,86.36 139.7,90.17 93.98,90.17 93.98,96.52 110.49,96.52 v110.49,106.68
N$151  (via drill 0.6)
  Top 0.406: v128.27,86.36 128.27,85.09 | v113.03,86.36 113.03,85.09 | v143.51,86.36 143.51,85.09 | v97.79,86.36 97.79,85.09 | v128.27,49.53 128.27,48.26 | v113.03,49.53 113.03,48.26 | v143.51,49.53 143.51,48.26 | v97.79,49.53 97.79,48.26 | v157.48,44.45 v154.94,44.45
  Bottom 0.406: v128.27,86.36 128.27,81.28 | v113.03,86.36 113.03,81.28 | v143.51,86.36 143.51,81.28 | 143.51,81.28 128.27,81.28 | 128.27,81.28 113.03,81.28 | 113.03,81.28 97.79,81.28 v97.79,86.36 | 143.51,81.28 157.48,81.28 v157.48,44.45 168.91,44.45 168.91,54.61 v171.45,54.61 | v128.27,49.53 128.27,44.45 | v113.03,49.53 113.03,44.45 | v143.51,49.53 143.51,44.45 | 143.51,44.45 128.27,44.45 | 128.27,44.45 113.03,44.45 | 113.03,44.45 97.79,44.45 v97.79,49.53 | 143.51,44.45 v154.94,44.45
N$156  (via drill 0.6)
  Top 0.406: v102.87,67.31 102.87,73.66 | v148.59,67.31 148.59,73.66 | 133.35,48.26 v133.35,55.88 | 148.59,48.26 v148.59,55.88 | 118.11,48.26 v118.11,55.88 | 102.87,48.26 v102.87,62.23 v118.11,62.23 v133.35,62.23 v148.59,62.23 v162.56,62.23 v171.45,62.23 | v118.11,67.31 118.11,73.66 | v133.35,67.31 133.35,73.66 | 133.35,85.09 v133.35,92.71 | 148.59,85.09 v148.59,92.71 | 118.11,85.09 v118.11,92.71 | 102.87,85.09 102.87,99.06 v118.11,99.06 v133.35,99.06 v148.59,99.06 v162.56,99.06 | v102.87,30.48 102.87,36.83 | v148.59,30.48 148.59,36.83 | v102.87,25.4 v118.11,25.4 v133.35,25.4 v148.59,25.4 162.56,25.4 v162.56,55.88 | v118.11,30.48 118.11,36.83 | v133.35,30.48 133.35,36.83
  Bottom 0.406: v118.11,55.88 v118.11,62.23 v118.11,67.31 | v148.59,55.88 v148.59,62.23 v148.59,67.31 | v133.35,55.88 v133.35,62.23 v133.35,67.31 | v102.87,67.31 v102.87,62.23 | v118.11,92.71 v118.11,99.06 | v148.59,92.71 v148.59,99.06 | v133.35,92.71 v133.35,99.06 | v162.56,99.06 v162.56,62.23 v162.56,55.88 | v118.11,25.4 v118.11,30.48 | v133.35,25.4 v133.35,30.48 | v148.59,30.48 v148.59,25.4 | v102.87,30.48 v102.87,25.4
N$160  (via drill 0.6)
  Top 0.406: v154.94,86.36 154.94,85.09
  Bottom 0.406: v154.94,86.36 154.94,91.44 95.25,91.44 95.25,95.25 111.76,95.25 v111.76,106.68
N$163  (via drill 0.6)
  Top 0.406: v143.51,72.39 143.51,73.66 | v96.52,68.58 v96.52,106.68
  Bottom 0.406: v143.51,72.39 143.51,68.58 v96.52,68.58
N$167  (via drill 0.6)
  Top 0.406: v113.03,72.39 113.03,73.66 | v93.98,71.12 v93.98,106.68
  Bottom 0.406: v113.03,72.39 113.03,71.12 v93.98,71.12
N$169  (via drill 0.6)
  Top 0.406: v128.27,72.39 128.27,73.66 | v95.25,106.68 v95.25,69.85
  Bottom 0.406: v128.27,72.39 128.27,69.85 v95.25,69.85
N$171  (via drill 0.6)
  Top 0.406: 100.33,73.66 v100.33,67.31 | 146.05,73.66 v146.05,67.31 | v130.81,55.88 130.81,48.26 | v146.05,55.88 146.05,48.26 | v115.57,55.88 115.57,48.26 | 100.33,48.26 v100.33,64.77 v115.57,64.77 v130.81,64.77 v146.05,64.77 v160.02,64.77 v171.45,64.77 | v115.57,67.31 115.57,73.66 | v130.81,67.31 130.81,73.66 | v130.81,92.71 130.81,85.09 | v146.05,92.71 146.05,85.09 | v115.57,92.71 115.57,85.09 | 100.33,85.09 100.33,101.6 v115.57,101.6 v130.81,101.6 v146.05,101.6 v160.02,101.6 | 100.33,36.83 v100.33,30.48 | 146.05,36.83 v146.05,30.48 | v100.33,27.94 v115.57,27.94 v130.81,27.94 v146.05,27.94 160.02,27.94 v160.02,55.88 | v115.57,30.48 115.57,36.83 | v130.81,30.48 130.81,36.83
  Bottom 0.406: v115.57,55.88 v115.57,64.77 v115.57,67.31 | v146.05,55.88 v146.05,64.77 v146.05,67.31 | v130.81,55.88 v130.81,64.77 v130.81,67.31 | v100.33,67.31 v100.33,64.77 | v115.57,92.71 v115.57,101.6 | v146.05,92.71 v146.05,101.6 | v130.81,92.71 v130.81,101.6 | v160.02,101.6 v160.02,64.77 v160.02,55.88 | v115.57,27.94 v115.57,30.48 | v130.81,27.94 v130.81,30.48 | v146.05,30.48 v146.05,27.94 | v100.33,30.48 v100.33,27.94
N$172  (via drill 0.6)
  Top 0.406: v97.79,72.39 97.79,73.66 | v92.71,106.68 v92.71,72.39
  Bottom 0.406: v97.79,72.39 v92.71,72.39
N$175  (via drill 0.6)
  Top 0.406: v113.03,35.56 113.03,36.83 | v88.9,106.68 v88.9,34.29
  Bottom 0.406: v113.03,35.56 113.03,34.29 v88.9,34.29
N$180  (via drill 0.6)
  Top 0.406: v101.6,30.48 101.6,36.83 | 132.08,36.83 v132.08,30.48 | 116.84,36.83 v116.84,30.48 | v101.6,26.67 v116.84,26.67 v132.08,26.67 v147.32,26.67 161.29,26.67 v161.29,55.88 | 147.32,36.83 v147.32,30.48 | 132.08,85.09 v132.08,92.71 | 147.32,85.09 v147.32,92.71 | 116.84,85.09 v116.84,92.71 | 101.6,85.09 101.6,100.33 v116.84,100.33 v132.08,100.33 v147.32,100.33 v161.29,100.33 | v101.6,67.31 101.6,73.66 | 132.08,73.66 v132.08,67.31 | 116.84,73.66 v116.84,67.31 | 132.08,48.26 v132.08,55.88 | 147.32,48.26 v147.32,55.88 | 116.84,48.26 v116.84,55.88 | 101.6,48.26 v101.6,63.5 v116.84,63.5 v132.08,63.5 v147.32,63.5 v161.29,63.5 v171.45,63.5 | 147.32,73.66 v147.32,67.31
  Bottom 0.406: v116.84,30.48 v116.84,26.67 | v132.08,30.48 v132.08,26.67 | v147.32,26.67 v147.32,30.48 | v101.6,30.48 v101.6,26.67 | v116.84,92.71 v116.84,100.33 | v147.32,92.71 v147.32,100.33 | v132.08,92.71 v132.08,100.33 | v116.84,55.88 v116.84,63.5 v116.84,67.31 | v147.32,55.88 v147.32,63.5 v147.32,67.31 | v132.08,55.88 v132.08,63.5 v132.08,67.31 | v101.6,67.31 v101.6,63.5 | v161.29,100.33 v161.29,63.5 v161.29,55.88
N$182  (via drill 0.6)
  Top 0.406: v104.14,30.48 104.14,36.83 | 134.62,36.83 v134.62,30.48 | v119.38,30.48 119.38,36.83 | v104.14,24.13 v119.38,24.13 v134.62,24.13 v149.86,24.13 163.83,24.13 v163.83,55.88 | 149.86,36.83 v149.86,30.48 | v134.62,92.71 134.62,85.09 | v149.86,92.71 149.86,85.09 | v119.38,92.71 119.38,85.09 | 104.14,85.09 104.14,97.79 v119.38,97.79 v134.62,97.79 v149.86,97.79 v163.83,97.79 | v104.14,67.31 104.14,73.66 | 134.62,73.66 v134.62,67.31 | v119.38,67.31 119.38,73.66 | v134.62,55.88 134.62,48.26 | v149.86,55.88 149.86,48.26 | v119.38,55.88 119.38,48.26 | 104.14,48.26 v104.14,60.96 v119.38,60.96 v134.62,60.96 v149.86,60.96 v163.83,60.96 v171.45,60.96 | 149.86,73.66 v149.86,67.31
  Bottom 0.406: v119.38,30.48 v119.38,24.13 | v134.62,30.48 v134.62,24.13 | v149.86,24.13 v149.86,30.48 | v104.14,30.48 v104.14,24.13 | v119.38,92.71 v119.38,97.79 | v149.86,92.71 v149.86,97.79 | v134.62,92.71 v134.62,97.79 | v119.38,55.88 v119.38,60.96 v119.38,67.31 | v149.86,55.88 v149.86,60.96 v149.86,67.31 | v134.62,55.88 v134.62,60.96 v134.62,67.31 | v104.14,67.31 v104.14,60.96 | v163.83,97.79 v163.83,60.96 v163.83,55.88
N$184  (via drill 0.6)
  Top 0.406: 106.68,36.83 v106.68,30.48 | 152.4,36.83 v152.4,30.48 | 137.16,36.83 v137.16,30.48 | v121.92,30.48 121.92,36.83 | v106.68,21.59 v121.92,21.59 v137.16,21.59 v152.4,21.59 166.37,21.59 v166.37,55.88 | v137.16,92.71 137.16,85.09 | v152.4,92.71 152.4,85.09 | v121.92,92.71 121.92,85.09 | 106.68,85.09 106.68,95.25 v121.92,95.25 v137.16,95.25 v152.4,95.25 v166.37,95.25 | 106.68,73.66 v106.68,67.31 | 152.4,73.66 v152.4,67.31 | 137.16,73.66 v137.16,67.31 | v121.92,67.31 121.92,73.66 | v137.16,55.88 137.16,48.26 | v152.4,55.88 152.4,48.26 | v121.92,55.88 121.92,48.26 | 106.68,48.26 v106.68,58.42 v121.92,58.42 v137.16,58.42 v152.4,58.42 v166.37,58.42 v171.45,58.42
  Bottom 0.406: v121.92,30.48 v121.92,21.59 | v137.16,30.48 v137.16,21.59 | v152.4,30.48 v152.4,21.59 | v106.68,30.48 v106.68,21.59 | v121.92,92.71 v121.92,95.25 | v152.4,92.71 v152.4,95.25 | v137.16,92.71 v137.16,95.25 | v121.92,55.88 v121.92,58.42 v121.92,67.31 | v152.4,55.88 v152.4,58.42 v152.4,67.31 | v137.16,55.88 v137.16,58.42 v137.16,67.31 | v106.68,67.31 v106.68,58.42 | v166.37,95.25 v166.37,58.42 v166.37,55.88
N$199  (via drill 0.6)
  Top 0.406: 153.67,85.09 153.67,93.98 | 153.67,93.98 v167.64,93.98 | 138.43,85.09 138.43,93.98 | 138.43,93.98 153.67,93.98 | 123.19,85.09 123.19,93.98 | 123.19,93.98 138.43,93.98 | 123.19,93.98 107.95,93.98 107.95,85.09 | 107.95,73.66 v107.95,67.31 | 123.19,48.26 v123.19,57.15 | 138.43,48.26 v138.43,57.15 | 107.95,48.26 v107.95,57.15 v123.19,57.15 | v123.19,57.15 v138.43,57.15 | v138.43,57.15 v153.67,57.15 | 153.67,48.26 v153.67,57.15 | v123.19,67.31 123.19,73.66 | v138.43,67.31 138.43,73.66 | v153.67,67.31 153.67,73.66 | 107.95,36.83 v107.95,30.48 | v107.95,20.32 v123.19,20.32 v138.43,20.32 v153.67,20.32 167.64,20.32 v167.64,57.15 | v123.19,30.48 123.19,36.83 | v138.43,30.48 138.43,36.83 | v153.67,30.48 153.67,36.83 | v167.64,57.15 v171.45,57.15 | v153.67,57.15 v167.64,57.15
  Bottom 0.406: v123.19,57.15 v123.19,67.31 | v138.43,57.15 v138.43,67.31 | v153.67,57.15 v153.67,67.31 | v107.95,67.31 v107.95,57.15 | v123.19,20.32 v123.19,30.48 | v138.43,20.32 v138.43,30.48 | v153.67,20.32 v153.67,30.48 | v107.95,30.48 v107.95,20.32 | v167.64,93.98 v167.64,57.15
VDD  (2 unrouted)
VSS  (2 unrouted)

### Text on the board
Top: INPUT ENABLE | OUTPUT ENABLE | D/Q7 / D/Q6 / D/Q5 / D/Q4 / D/Q3 / D/Q2 / D/Q1 / D/Q0 | GND / VCC | A3 A2 A1 A0 VCC GND RE WE